# EAGLE design MEP_SAO (EAGLE 9.0.1)
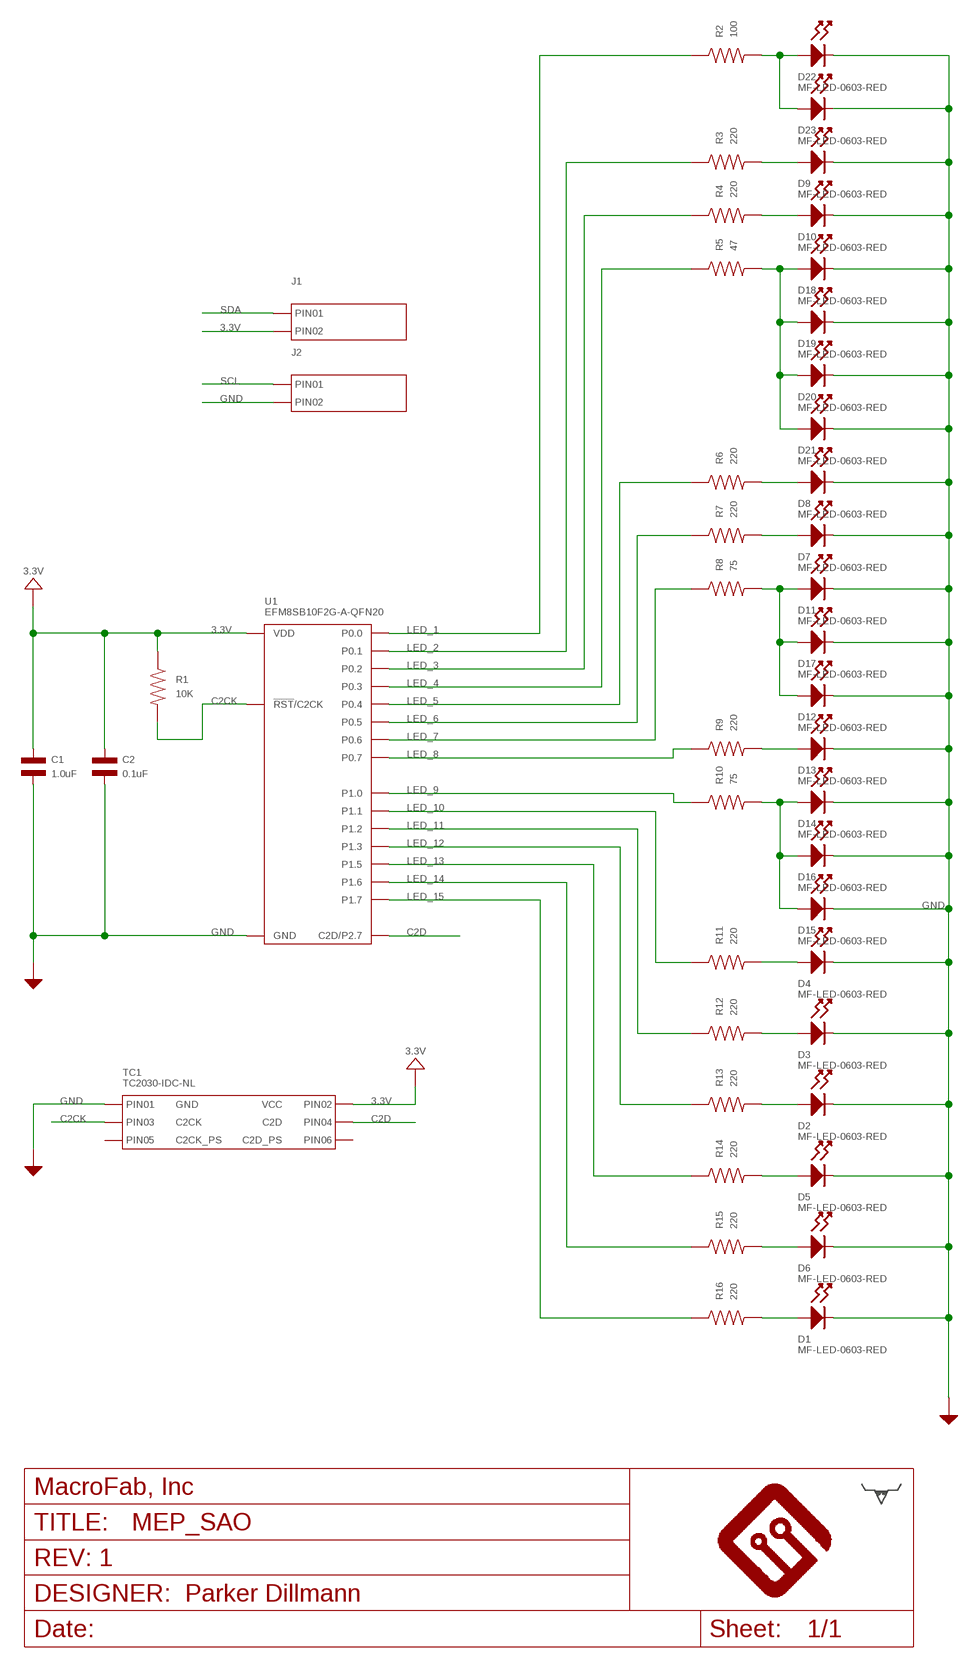
[diagram p0: schematic, sheet 1]

## Parts
C1  1.0uF  CAPACITOR_NP_0603  [C0603]
C2  0.1uF  CAPACITOR_NP_0603  [C0603]
D1  MF-LED-0603-RED  LED_SINGLE-0603-RED  [LED0603]
D2  MF-LED-0603-RED  LED_SINGLE-0603-RED  [LED0603]
D3  MF-LED-0603-RED  LED_SINGLE-0603-RED  [LED0603]
D4  MF-LED-0603-RED  LED_SINGLE-0603-RED  [LED0603]
D5  MF-LED-0603-RED  LED_SINGLE-0603-RED  [LED0603]
D6  MF-LED-0603-RED  LED_SINGLE-0603-RED  [LED0603]
D7  MF-LED-0603-RED  LED_SINGLE-0603-RED  [LED0603]
D8  MF-LED-0603-RED  LED_SINGLE-0603-RED  [LED0603]
D9  MF-LED-0603-RED  LED_SINGLE-0603-RED  [LED0603]
D10  MF-LED-0603-RED  LED_SINGLE-0603-RED  [LED0603]
D11  MF-LED-0603-RED  LED_SINGLE-0603-RED  [LED0603]
D12  MF-LED-0603-RED  LED_SINGLE-0603-RED  [LED0603]
D13  MF-LED-0603-RED  LED_SINGLE-0603-RED  [LED0603]
D14  MF-LED-0603-RED  LED_SINGLE-0603-RED  [LED0603]
D15  MF-LED-0603-RED  LED_SINGLE-0603-RED  [LED0603]
D16  MF-LED-0603-RED  LED_SINGLE-0603-RED  [LED0603]
D17  MF-LED-0603-RED  LED_SINGLE-0603-RED  [LED0603]
D18  MF-LED-0603-RED  LED_SINGLE-0603-RED  [LED0603]
D19  MF-LED-0603-RED  LED_SINGLE-0603-RED  [LED0603]
D20  MF-LED-0603-RED  LED_SINGLE-0603-RED  [LED0603]
D21  MF-LED-0603-RED  LED_SINGLE-0603-RED  [LED0603]
D22  MF-LED-0603-RED  LED_SINGLE-0603-RED  [LED0603]
D23  MF-LED-0603-RED  LED_SINGLE-0603-RED  [LED0603]
FRAME1  MF_FRAMEDEFAULT  [MF_FRAME_DEFAULT]
J1  CON_01X02_2.54MM_PIN_HEADER  [2.54MM_01X02_PIN_HEADER]
J2  CON_01X02_2.54MM_PIN_HEADER  [2.54MM_01X02_PIN_HEADER]
R1  10K  RESISTOR_0402  [R0402]
R2  100  RESISTOR_0402  [R0402]
R3  220  RESISTOR_0402  [R0402]
R4  220  RESISTOR_0402  [R0402]
R5  47  RESISTOR_0402  [R0402]
R6  220  RESISTOR_0402  [R0402]
R7  220  RESISTOR_0402  [R0402]
R8  75  RESISTOR_0402  [R0402]
R9  220  RESISTOR_0402  [R0402]
R10  75  RESISTOR_0402  [R0402]
R11  220  RESISTOR_0402  [R0402]
R12  220  RESISTOR_0402  [R0402]
R13  220  RESISTOR_0402  [R0402]
R14  220  RESISTOR_0402  [R0402]
R15  220  RESISTOR_0402  [R0402]
R16  220  RESISTOR_0402  [R0402]
TC1  TC2030-IDC-NL  CON_02X03_SILABS2TC_TC2030-IDC-NL  [TC2030-IDC-NL]
U1  EFM8SB10F2G-A-QFN20  EFM8SB10F(2/4/8)G-A-QFN20  [EFM8SB10F(2/4/8)G-A-QFN20]
U$6  LHE_LOGOLHE_LOGO  [LHE_LOGO]

## Nets
3.3V: C1.P$1 C2.P$1 J1.2(PIN2) R1.P$1 TC1.P$2(PIN2) U1.P$4(VDD)
C2CK: R1.P$2 TC1.P$3(PIN3) U1.P$5(!RST!/C2CK)
C2D: TC1.P$4(PIN4) U1.P$6(C2D/P2.7)
GND: C1.P$2 C2.P$2 D1.CATHODE D2.CATHODE D3.CATHODE D4.CATHODE D5.CATHODE D6.CATHODE D7.CATHODE D8.CATHODE D9.CATHODE D10.CATHODE D11.CATHODE D12.CATHODE D13.CATHODE D14.CATHODE D15.CATHODE D16.CATHODE D17.CATHODE D18.CATHODE D19.CATHODE D20.CATHODE D21.CATHODE D22.CATHODE D23.CATHODE J2.2(PIN2) TC1.P$1(PIN1) U1.P$3(GND) U1.P$12(GND) U1.PAD(GND)
LED_1: R2.P$1 U1.P$2(P0.0)
LED_2: R3.P$1 U1.P$1(P0.1)
LED_3: R4.P$1 U1.P$20(P0.2)
LED_4: R5.P$1 U1.P$19(P0.3)
LED_5: R6.P$1 U1.P$18(P0.4)
LED_6: R7.P$1 U1.P$17(P0.5)
LED_7: R8.P$1 U1.P$16(P0.6)
LED_8: R9.P$1 U1.P$15(P0.7)
LED_9: R10.P$1 U1.P$14(P1.0)
LED_10: R11.P$1 U1.P$13(P1.1)
LED_11: R12.P$1 U1.P$11(P1.2)
LED_12: R13.P$1 U1.P$10(P1.3)
LED_13: R14.P$1 U1.P$9(P1.5)
LED_14: R15.P$1 U1.P$8(P1.6)
LED_15: R16.P$1 U1.P$7(P1.7)
N$1: D22.ANODE D23.ANODE R2.P$2
N$2: D18.ANODE D19.ANODE D20.ANODE D21.ANODE R5.P$2
N$3: D10.ANODE R4.P$2
N$4: D7.ANODE R7.P$2
N$5: D1.ANODE R16.P$2
N$6: D13.ANODE R9.P$2
N$7: D9.ANODE R3.P$2
N$8: D8.ANODE R6.P$2
N$9: D6.ANODE R15.P$2
N$10: D5.ANODE R14.P$2
N$11: D2.ANODE R13.P$2
N$12: D3.ANODE R12.P$2
N$13: D4.ANODE R11.P$2
N$17: D14.ANODE D15.ANODE D16.ANODE R10.P$2
N$20: D11.ANODE D12.ANODE D17.ANODE R8.P$2
SCL: J2.1(PIN1)
SDA: J1.1(PIN1)
Unconnected: TC1.P$5(PIN5) TC1.P$6(PIN6)

## Library data of the parts
C1 = MF_Passives:CAPACITOR_NP: Library: MF_Passives Description: Device for Non-Polarized Capacitors. Manufacture part number (MPN) can be added via Attributes. Check https://factory.macrofab.com/parts for the house parts list.; MPN: MF-CAP-0603-1uF; POPULATE: 1
C2 = MF_Passives:CAPACITOR_NP: Library: MF_Passives Description: Device for Non-Polarized Capacitors. Manufacture part number (MPN) can be added via Attributes. Check https://factory.macrofab.com/parts for the house parts list.; MPN: MF-CAP-0603-0.1uF; POPULATE: 1
D1-D23 = MF_LEDs:LED_SINGLE: Library: MF_LEDs Description: Device for Single LED Packages. Manufacture part number (MFG#) can be added via Attributes.; HOUSEPART: YES; MPN: MF-LED-0603-RED; POPULATE: 1; URL: https://factory.macrofab.com/part/MF-LED-0603-RED
FRAME1 = MF_Aesthetics:MF_FRAME: Library: MF_Aesthetics Description: Frame for adding Meta Data to the PCB and Schematic.; DNAME: Parker Dillmann; HOUSEPART: 0; POPULATE: 0; REVNUM: REV: 1
J1 J2 = PP_Connectors:CON_01X02; POPULATE: 0
R1 = MF_Passives:RESISTOR: Library: MF_Passives Description: Device for Resistors. Manufacture part number (MPN), Voltage, Tolerance, and Wattage Rating can be added via Attributes. Check https://factory.macrofab.com/parts for the house parts list.; MPN: MF-RES-0402-10K; POPULATE: 1
R2 = MF_Passives:RESISTOR: Library: MF_Passives Description: Device for Resistors. Manufacture part number (MPN), Voltage, Tolerance, and Wattage Rating can be added via Attributes. Check https://factory.macrofab.com/parts for the house parts list.; MPN: MF-RES-0402-100; POPULATE: 1
R3 R4 R6 R7 R9 R11-R16 = MF_Passives:RESISTOR: Library: MF_Passives Description: Device for Resistors. Manufacture part number (MPN), Voltage, Tolerance, and Wattage Rating can be added via Attributes. Check https://factory.macrofab.com/parts for the house parts list.; MPN: MF-RES-0402-220; POPULATE: 1
R5 = MF_Passives:RESISTOR: Library: MF_Passives Description: Device for Resistors. Manufacture part number (MPN), Voltage, Tolerance, and Wattage Rating can be added via Attributes. Check https://factory.macrofab.com/parts for the house parts list.; MPN: MF-RES-0402-47; POPULATE: 1
R8 R10 = MF_Passives:RESISTOR: Library: MF_Passives Description: Device for Resistors. Manufacture part number (MPN), Voltage, Tolerance, and Wattage Rating can be added via Attributes. Check https://factory.macrofab.com/parts for the house parts list.; MPN: MF-RES-0402-75; POPULATE: 1
TC1 = MF_Connectors:CON_02X03: Library: MF_Connectors Description: Header Connector with 6 Positions and 02 Rows. Use the LABEL Attribute to label the pin on the schematic and PCB. You can remove the attributes on the PCB by using the SMASH function on the part and then deleting the text.; HOUSEPART: NO; LABEL01: GND; LABEL02: VCC; LABEL03: C2CK; LABEL04: C2D; LABEL05: C2CK_PS; LABEL06: C2D_PS; MPN: TC2030-IDC-NL; POPULATE: 0; URL: http://www.tag-connect.com/TC2030-IDC-NL
U1 = MF_IC_Digital:EFM8SB10F(2/4/8)G-A-QFN20: Manufacturer Part #: EFM8SB10F(2/4/8)G-A-QFN20 Manufacturer: Silicon Labs Description: Sleepy Bee 8-bit Microcontrollers - MCU 8kB/512B RAM 12b ADC; HOUSEPART: NO; POPULATE: 1; URL: http://www.silabs.com/products/mcu/8-bit/efm8-sleepy-bee/pages/efm8-sleepy-bee.aspx
U$6 = PP_Aesthetics:LHE_LOGO; POPULATE: 0

## Board
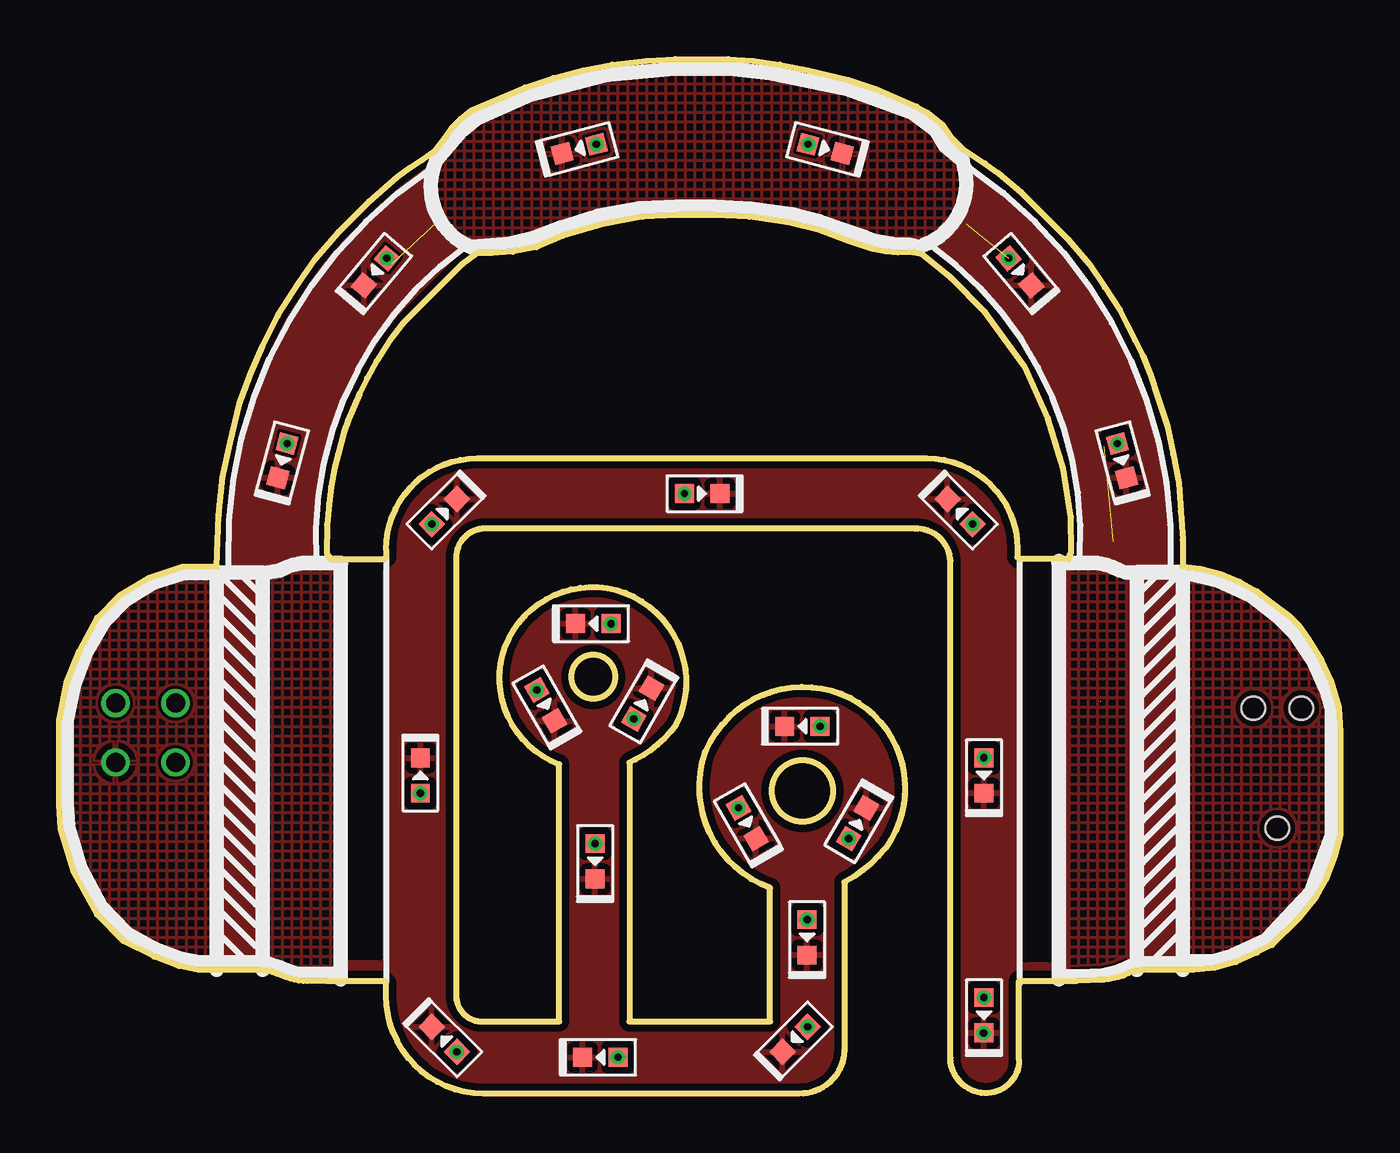
[diagram p1: board, top side]
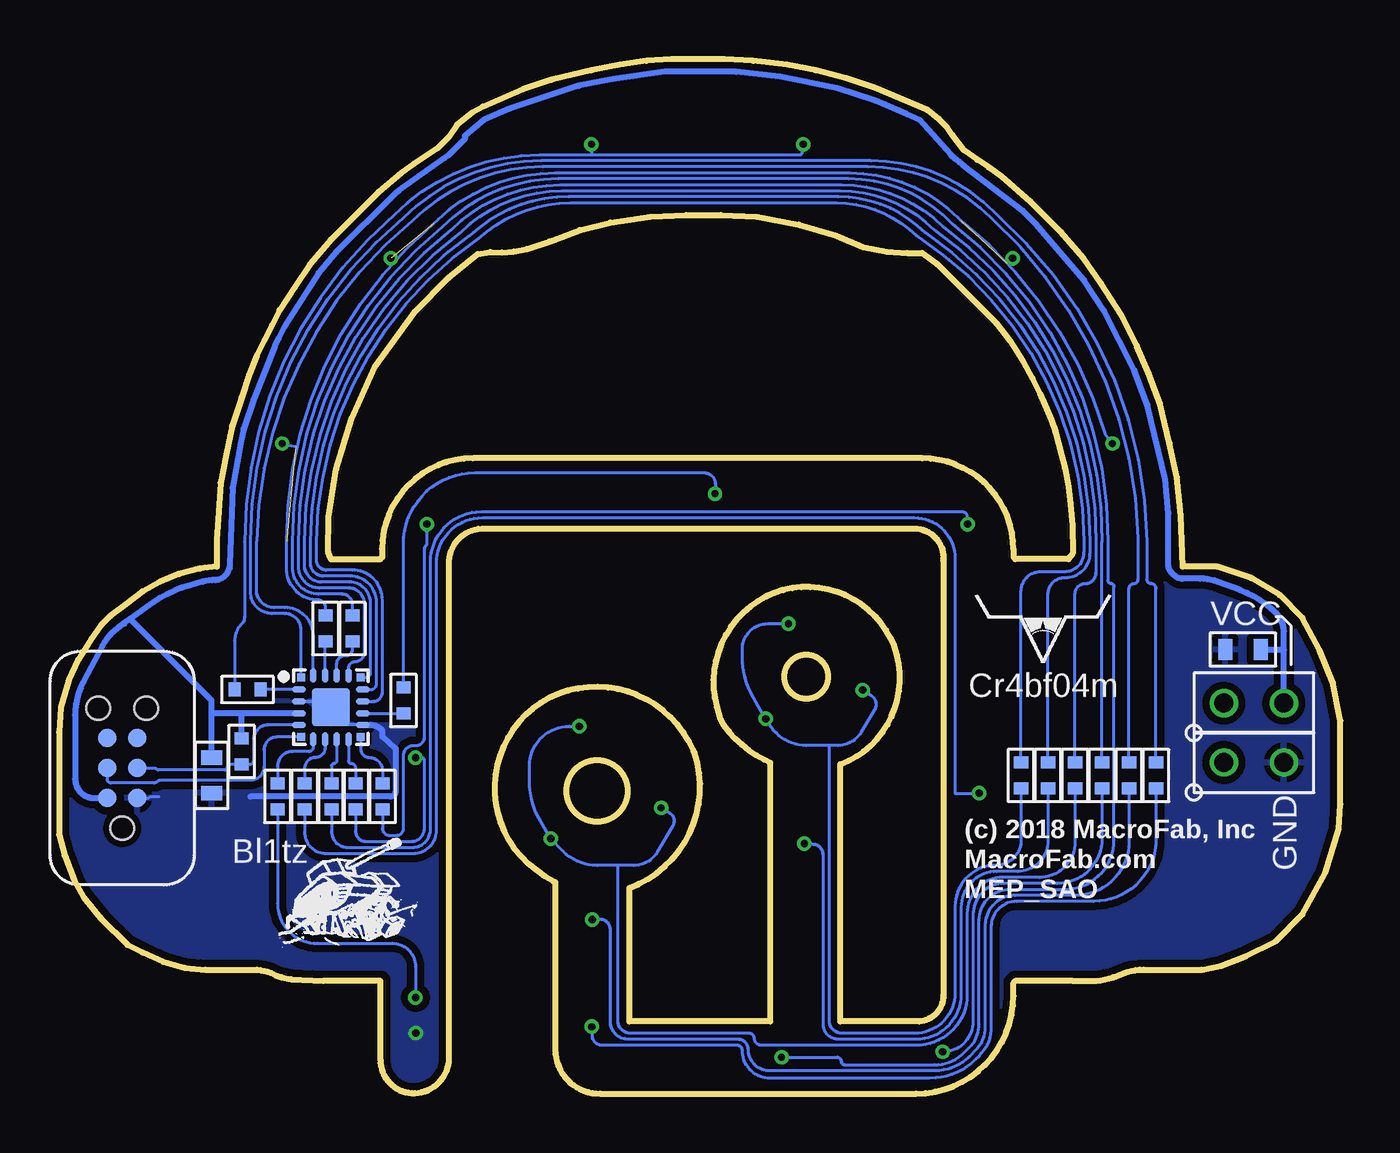
[diagram p2: board, bottom side, seen from below]

Size 54.28 x 43.83 mm. Coordinates in mm from the lower left corner, seen from the top.
Outline: 9.62,4.94 9.2,5.1 arc20 8.33,5.25 5.88,5.25 5.07,5.41 4.03,5.82 2.74,6.46 1.61,7.59 0.64,9.36 0.08,11.21 0,12.26 0,15.8 0.32,17.41 0.89,18.78 1.61,20.15 2.58,21.12 3.78,21.84 5.23,22.33 6.68,22.33 6.76,24.5 6.93,26.11 7.25,27.56 7.65,29.25 8.13,30.54 8.62,31.67 9.26,32.96 10.15,34.33 10.87,35.37 11.84,36.5 13.13,37.79 14.33,38.84 14.9,39.24 15.38,39.56 15.95,39.96 16.43,40.61 16.65,40.93 17,41.28 17.48,41.65 19.73,42.62 20.94,43.02 22.23,43.35 23.44,43.59 24.88,43.75 26.09,43.83 28.35,43.83 29.39,43.75 30.52,43.59 31.73,43.35 33.42,42.94 34.63,42.54 36.32,41.82 36.77,41.56 37.42,41.04 37.77,40.53 38.25,40.04 39.22,39.4 39.78,39 40.75,38.19 42.76,36.18 43.65,35.13 44.29,34.16 44.94,33.2 45.26,32.55 45.58,31.91 45.9,31.27 46.23,30.46 46.55,29.49 46.95,28.29 47.19,27.08 47.43,25.87 47.52,24.66 47.6,23.45 47.6,22.33 48.32,22.25 49.21,22 50.01,21.68 50.74,21.28 51.46,20.72 52.11,20.23 52.51,19.83 52.91,19.27 53.47,18.38 53.88,17.49 54.2,16.37 54.28,15.32 54.28,10.97 54.04,10.08 53.64,9.04 53.23,8.31 52.51,7.43 51.38,6.3 50.74,5.98 49.85,5.57 48.96,5.33 48.08,5.25 45.89,5.25 arc14 45.3,5.11 45.1,5.01 44.86,4.93 44.45,4.85 43.09,4.77 40.67,4.77 40.67,1.42 arc-87 39.35,0.02 arc-93 37.76,1.51 37.76,22.57 arc90 36.24,23.94 17.92,23.94 arc90 16.83,22.57 16.83,4.18 arc89 17.85,3.06 21.18,3.06 21.18,13.95 arc-89 18.9,18.94 arc-94 24.33,21.06 24.33,21.05 arc-90 26.13,15.62 arc-28 24.4,14.15 24.16,14.03 24.16,3.06 30.12,3.06 30.12,8.72 arc-88 27.35,14.43 27.41,14.54 arc-93 33.52,16.77 arc-98 35.01,10.4 arc-23 33.32,8.99 33.26,8.96 33.26,1.85 arc-90 31.35,0 17.97,0 arc-90 13.85,4.14 13.85,4.69 13.77,4.77 11.36,4.77 10.53,4.77 arc-20 9.62,4.94
Outline: 42.76,22.65 42.88,22.95 42.86,24.42 42.54,26.45 41.89,28.61 40.91,30.78 39.22,33.12 37.77,34.57 36.55,35.57 36.02,35.65 35.52,35.63 35.02,35.68 34.47,35.78 33.5,36.1 32.21,36.58 30.93,36.9 29.23,37.14 27.7,37.22 26.25,37.22 24.72,37.14 22.95,36.82 21.34,36.34 20.21,35.86 19.21,35.66 18.36,35.61 17.72,35.61 17.07,35.13 14.58,32.63 14.01,31.91 13.45,31.02 13.05,30.3 12.72,29.65 12.24,28.53 12.08,28.04 11.82,27.08 11.68,26.51 11.52,25.71 11.44,24.98 11.36,24.1 11.34,22.89 11.52,22.65 13.77,22.65 13.85,22.73 13.85,23.05 arc-90 17.72,26.92 36.75,26.92 arc-90 40.6,23.07 40.59,22.73 40.67,22.65 42.76,22.65
Outline: circle at 22.63,17.65 radius 0.92
Outline: circle at 31.49,12.82 radius 1.3
Copper layers (1*16): Top 0.035mm / dielectric 1.5mm / Bottom 0.035mm
Design rules "MF_Standard_2_Layer": minimum track width 5mil, minimum drill 12mil, track to track 5mil, track to pad 5mil, pad to pad 5mil, via to via 5mil, smd to smd 0mil, copper to edge 10mil, drill to drill 10mil, minimum pad ring 6mil, minimum via ring 6mil, stop-mask expansion 2mil, vias tented up to drill 25mil, thermal gap 10mil

### Footprints (pad centres in the part's own frame; a part is rotated, then mirrored left to right if it is on the bottom)
C0603 = smd 0.6 x 0.9: P$1 -0.75,0; P$2 0.75,0
LED0603 = smd 0.8 x 0.8: ANODE 0.75,0; CATHODE -0.75,0
2.54MM_01X02_PIN_HEADER = drill 0.8: 1 -1.27,0; 2 1.27,0
R0402 = smd 0.5 x 0.6: P$1 -0.55,0; P$2 0.55,0
TC2030-IDC-NL = smd 0.787 x 0.787: P$1 -1.27,-0.635; P$2 -1.27,0.635; P$3 0,-0.635; P$4 0,0.635; P$5 1.27,-0.635; P$6 1.27,0.635 | hole 0.991: 2.54,1.016; 2.54,-1.016; -2.54,0
EFM8SB10F(2/4/8)G-A-QFN20 = smd 0.34 x 0.34: P$1 -1.265,1.265; P$6 -1.265,-1.265; P$11 1.265,-1.265; P$16 1.265,1.265 | smd 0.61 x 0.28: P$2 -1.355,0.75; P$3 -1.355,0.25; P$4 -1.355,-0.25; P$5 -1.355,-0.75; P$12 1.355,-0.75; P$13 1.355,-0.25; P$14 1.355,0.25; P$15 1.355,0.75 | smd 0.28 x 0.61: P$7 -0.75,-1.355; P$8 -0.25,-1.355; P$9 0.25,-1.355; P$10 0.75,-1.355; P$17 0.75,1.355; P$18 0.25,1.355; P$19 -0.25,1.355; P$20 -0.75,1.355 | smd 1.6 x 1.6: PAD 0,0

### Placement (x,y rotation side)
C1  4.13,18.81 180 bottom
C2  47.82,13.48 270 bottom
D1  39.18,3.32 90 top
D2  39.18,13.48 90 top
D3  38.17,24.66 315 top
D4  27.24,25.42 180 top
D5  16.32,24.66 225 top
D6  15.31,13.48 270 top
D7  16.32,2.3 315 top
D8  22.93,1.54 0 top
D9  31.18,2.3 45 top
D10  31.69,6.62 90 top
D11  33.82,11.45 240 top
D12  31.49,15.56 0 top
D13  22.71,9.84 90 top
D14  24.72,16.53 240 top
D15  22.63,19.91 0 top
D16  20.62,16.45 120 top
D17  29.15,11.45 120 top
D18  45.02,26.81 105 top
D19  40.71,34.82 130 top
D20  13.4,34.82 50 top
D21  9.46,26.81 75 top
D22  32.45,40.02 165 top
D23  22.04,40.02 15 top
FRAME1  15.94,12.08 0 bottom
J1  3.67,16.54 0 bottom
J2  3.67,14.03 0 bottom
R1  46.55,14.5 270 bottom
R2  46.29,17.12 180 bottom
R3  7.81,13.48 270 bottom
R4  8.96,13.48 270 bottom
R5  42.99,19.7 90 bottom
R6  41.85,19.7 90 bottom
R7  10.1,13.48 270 bottom
R8  11.24,13.48 270 bottom
R9  12.38,13.48 270 bottom
R10  13.53,13.48 270 bottom
R11  39.69,16.65 90 bottom
R12  40.58,12.59 270 bottom
R13  41.72,12.59 270 bottom
R14  42.74,12.59 270 bottom
R15  43.88,12.59 270 bottom
R16  45.02,12.59 270 bottom
TC1  51.6,13.79 90 bottom
U1  42.76,16.37 0 bottom
U$6  10.61,18.18 0 bottom

### Tracks (layer width: path | path; a pad name or v marks a point on that pad's centre or on a via)
3.3V
  Bottom 0.254: J1.2 2.4,18.81 | 2.4,18.81 2.4,19.58 arc-45 2.71,20.34 arc-25 4.25,21.33 5.2,21.68 arc-20 5.95,21.82 6.69,21.82 arc45 7.04,21.96 7.18,22.1 7.18,22.11 arc45 7.28,22.35 7.28,24.58 7.43,26.01 8.18,29.17 8.73,30.63 10.02,33.16 10.87,34.47 12.89,36.84 13.47,37.41 15.97,39.31 arc11 16.15,39.48 | 16.15,39.48 | 16.15,39.48 16.16,39.49 16.3,39.6 | 16.3,39.6 | 16.3,39.6 arc13 16.5,39.77 17.83,41.25 18.36,41.48 19.69,42.05 21.33,42.6 23.73,43.08 25.6,43.29 25.8,43.3 28.63,43.3 30.83,42.98 32.26,42.7 35.2,41.72 36.28,41.26 37.09,40.57 37.09,40.45 37.8,39.74 37.93,39.65 39.89,38.25 40.06,38.11 42.54,35.65 43.29,34.76 44.72,32.51 44.97,32 45.15,31.65 46.04,29.4 46.46,28.15 46.58,27.56 46.93,25.67 47.04,22.43 arc45 47.29,21.9 arc43 47.66,21.76 arc-15 48.19,21.69 48.74,21.54 arc-20 50.28,20.81 51.27,20.11 | 51.27,20.11 51.56,19.91 | 51.56,19.91 arc-10 52.08,19.47 arc-17 52.44,18.99 53.25,17.44 arc-28 53.59,16.04 53.59,13.33 arc-90 52.79,12.52 TC1.P$2 | C1.P$1 2.4,18.81 | 51.52,19.91 51.56,19.91 | C2.P$1 47.82,16.12 | 47.82,16.12 47.82,16.66 51.27,20.11 | U1.P$4 46.55,16.12 | 46.55,16.12 47.82,16.12 | R1.P$1 46.55,16.12
C2CK
  Bottom 0.127: U1.P$5 45.43,15.62 arc-90 46.04,15.01 46.04,14.1 arc90 46.2,13.95 R1.P$2 47.02,13.95 arc-90 47.16,13.81 arc90 47.25,13.71 50.08,13.71 arc45 50.12,13.73 arc-45 50.26,13.78 TC1.P$3
C2D
  Bottom 0.127: TC1.P$4 52.24,13.32 arc-90 52.08,13.16 50.25,13.16 arc-45 50.13,13.21 arc45 49.98,13.28 46.17,13.28 arc-90 45.59,13.86 45.59,14.57 arc90 45.06,15.1 U1.P$6
GND  (via drill 0.3)  (1 unrouted)
  Bottom 0.127: TC1.P$1 50.48,12.52 50.41,12.59 50.04,12.59 | U1.P$12 41.47,15.62 41.47,15.64
  Bottom 0.152: 41.47,15.64 42.1,15.64 42.36,15.89 | 43.37,16.6 44.13,16.6
  Bottom 0.254: U1.P$12 41.14,15.62 arc45 40.58,15.38 40.58,15.13 40.02,14.62 40.02,12.81 arc90 40.23,12.59 46.17,12.59 | 43.37,16.6 43,16.6 U1.PAD 42.36,15.96 42.36,15.89
  other vias: 39.17,2.57
  pour Top (isolate 0.305, rank 6): 9.32,-0.61 11.7,4.8 11.7,22.65 15.86,41.49 15.91,41.49 15.91,40.05 15.68,39.01 15.81,37.74 16.44,36.58 17.71,35.58 36.39,35.58 37.54,36.34 38.15,37.49 38.53,38.63 38.15,40.13 38.15,42.25 58.05,22.25 42.81,22.29 42.78,4.77 44.96,-0.61
  pour Bottom (isolate 0.305, rank 6): 9.32,-0.61 -0.32,9.03 -0.32,25.31 18.59,44.21 36.18,44.21 54.93,25.46 54.93,9.36 44.96,-0.61
  pour Top (hatched): 15.93,44.64 15.91,39.96 15.68,38.99 15.83,37.72 16.46,36.6 17.71,35.56 36.44,35.58 37.56,36.34 38.17,37.47 38.55,38.63 38.17,40.13 38.17,44.6
  pour Top (hatched): 6.69,22.72 -0.59,22.74 -0.63,4.97 6.52,4.97
  pour Top (hatched): 55.03,22.32 47.61,22.36 47.59,4.61 54.87,4.56
  pour Top (hatched): 42.81,22.29 43.95,22.3 44.46,22.17 44.84,22 45.13,21.89 45.24,21.89 45.24,5.79 44.62,5.56 44.16,5.45 42.78,5.39 42.81,22.3
  pour Top: 45.32,23.1 47.63,23.1 47.63,4.56 45.32,4.56
  pour Top: 6.65,4.86 8.83,4.9 8.83,22.4 6.65,22.36
  pour Top: 6.62,22.15 9.06,22.15 9.06,21.85 9.86,22.19 10.35,22.3 11.87,22.3 18.07,35.33 16.72,36.37 16.44,36.58 15.81,37.72 15.7,39.01 15.96,40.03 6.62,40.03
  pour Top (hatched): 8.87,21.87 9.88,22.19 10.35,22.3 11.68,22.32 11.72,5.18 9.54,5.39 8.85,5.73
LED_1
  Bottom 0.127: U1.P$2 45.11,17.12 R2.P$1
LED_2
  Bottom 0.127: U1.P$1 44.03,19.64 arc-90 44.73,20.34 45.26,20.34 arc90 46.17,21.25 46.17,23.39 arc51 39.69,37.1 arc45 33.86,39.51 19.88,39.51 arc45 14.67,37.36 14.54,37.23 arc48 8.19,23.39 8.19,21.77 arc-90 8.03,21.61 arc90 7.81,21.39 R3.P$1
LED_3
  Bottom 0.127: U1.P$20 43.51,19.38 arc-90 44.71,20.59 45.18,20.59 arc90 45.91,21.33 45.91,23.39 arc50 39.31,36.97 arc45 33.79,39.26 20.01,39.26 arc45 14.8,37.1 arc46 8.57,23.51 8.57,21.77 arc90 8.74,21.61 arc-90 8.96,21.39 R4.P$1
LED_4
  Bottom 0.127: U1.P$19 43.01,19.15 R5.P$1
LED_5
  Bottom 0.127: U1.P$18 42.51,18.2 arc90 42.16,18.56 42.11,18.56 arc-90 41.85,18.82 R6.P$1
LED_6
  Bottom 0.127: U1.P$17 42.01,18.03 arc90 41.73,18.31 arc-90 41.34,18.7 41.34,20.75 arc-90 42.01,21.42 43.25,21.42 arc90 44.13,22.31 44.13,23.39 arc52 37.66,36.59 arc45 33.06,38.5 21.12,38.5 arc45 16.83,36.72 arc54 10.1,23.39 R7.P$1
LED_7
  Bottom 0.127: U1.P$16 41.28,17.63 arc-90 41.09,17.83 41.09,20.78 arc-90 41.97,21.67 43.17,21.67 arc90 43.88,22.39 43.88,23.39 arc53 37.28,36.47 arc45 32.98,38.24 21.2,38.24 arc45 17.21,36.59 arc55 10.35,23.39 10.35,22.07 arc90 10.81,21.61 arc-90 11.24,21.18 R8.P$1
LED_8
  Bottom 0.127: U1.P$15 41.08,17.12 arc-90 40.83,17.36 40.83,20.82 arc-90 41.94,21.92 43.09,21.92 arc90 43.63,22.47 43.63,23.39 arc54 36.9,36.34 arc43 32.69,37.99 21.27,37.99 arc45 17.59,36.47 arc56 10.61,23.39 10.61,22.89 arc90 11.63,21.86 11.69,21.86 arc-90 12.38,21.17 R9.P$1
LED_9
  Bottom 0.127: U1.P$14 40.98,16.62 arc-90 40.58,17.02 40.58,20.9 arc-90 41.86,22.18 42.96,22.18 arc90 43.37,22.59 43.37,23.39 arc55 36.51,36.21 arc43 32.62,37.74 21.35,37.74 arc45 17.97,36.34 arc57 10.86,23.39 10.86,22.94 arc90 11.68,22.12 12.71,22.12 arc-90 13.53,21.3 R10.P$1
LED_10
  Bottom 0.127: U1.P$13 R11.P$1
LED_11
  Bottom 0.127: U1.P$11 41.5,14.6 arc-90 41.14,14.24 arc90 40.58,13.68 R12.P$1
LED_12
  Bottom 0.127: U1.P$10 42.01,14.1 arc-90 41.91,13.99 arc90 41.72,13.8 R13.P$1
LED_13
  Bottom 0.127: U1.P$9 42.51,14.11 arc90 42.63,13.99 arc-90 42.74,13.88 R14.P$1
LED_14
  Bottom 0.127: U1.P$8 43.01,14.63 arc90 43.4,14.24 arc-90 43.88,13.77 R15.P$1
LED_15
  Bottom 0.127: U1.P$7 43.51,14.67 arc90 43.69,14.5 44.39,14.5 arc-90 45.02,13.86 R16.P$1
N$1  (via drill 0.3)
  Bottom 0.127: 31.69,39.77 33.94,39.77 arc-45 40.07,37.23 arc-49 46.42,23.39 46.42,20.21 arc45 46.56,19.88 arc-45 46.84,19.18 R2.P$2 | 31.69,39.77 22.9,39.77 arc-90 22.8,39.87 22.8,40.15 22.73,40.21 22.74,40.22 D23.ANODE | D22.ANODE 31.73,39.81 31.69,39.77
  other vias: 22.76,40.22 31.73,40.22
N$2  (via drill 0.3)  (3 unrouted)
  Bottom 0.127: R5.P$2 42.99,20.6 arc-90 43.3,20.91 arc90 44.64,22.25 44.64,23.39 arc50 38.42,36.85 38.21,37.05 arc43 33.28,39.01 20.78,39.01 arc45 16.2,37.11 16.07,36.97 arc35 9.97,27.96 D21.ANODE 9.74,27.54 | D18.ANODE 44.26,27.41 | D20.ANODE 14.11,35.17
  other vias: 44.83,27.54 40.22,35.39 13.88,35.39 9.66,27.54
N$3  (via drill 0.3)
  Bottom 0.127: R4.P$2 8.96,10.68 arc90 11.23,8.4 13.78,8.4 arc-90 15.05,7.13 15.05,2.83 arc45 15.47,1.83 15.73,1.57 arc45 17.16,0.97 24.18,0.97 arc90 25.08,1.87 arc-90 25.52,2.3 30.17,2.3 arc90 30.93,3.06 30.93,6.95 arc-90 31.36,7.38 31.69,7.38 D10.ANODE
  other vias: 31.69,7.37
N$4  (via drill 0.3)
  Bottom 0.127: R7.P$2 10.1,10.81 arc90 12,8.91 14.26,8.91 arc-90 15.56,7.61 15.56,3.07 arc90 D7.ANODE
  other vias: 16.85,1.77
N$5  (via drill 0.3)
  Bottom 0.127: R16.P$2 45.02,8.05 arc-90 43.34,6.37 40.17,6.37 arc90 39.18,5.38 D1.ANODE 39.18,4.02
  other vias: 39.18,4.07
N$6  (via drill 0.3)
  Bottom 0.127: R9.P$2 12.38,10.72 arc90 13.69,9.42 14.56,9.42 arc-90 16.07,7.9 16.07,4.21 arc90 17.97,2.3 21.27,2.3 arc90 21.91,2.94 21.91,10.12 arc-90 22.34,10.56 22.71,10.56 D13.ANODE
  other vias: 22.71,10.59
N$7  (via drill 0.3)
  Bottom 0.127: R3.P$2 7.81,10.78 arc90 10.45,8.15 13.72,8.15 arc-90 14.8,7.07 14.8,2.82 arc45 15.3,1.61 15.45,1.46 arc45 17.39,0.65 24.16,0.65 arc90 25.34,1.83 arc-90 25.56,2.05 31.28,2.05 arc90 31.69,2.46 31.69,2.83 D9.ANODE
  other vias: 31.71,2.83
N$8  (via drill 0.3)
  Bottom 0.127: R6.P$2 41.85,20.71 arc-90 42.3,21.16 43.28,21.16 arc90 44.39,22.27 44.39,23.39 arc51 38.04,36.72 arc45 33.13,38.75 20.83,38.75 arc47 16.45,36.85 arc53 9.84,23.39 9.84,21.73 arc-90 9.72,21.61 arc90 9.59,21.48 9.59,10.75 arc90 11.68,8.65 14,8.65 arc-90 15.31,7.35 15.31,2.95 arc45 15.72,1.95 15.92,1.75 arc45 17.19,1.22 21,1.22 arc90 21.15,1.37 arc-90 21.32,1.54 D8.ANODE
  other vias: 23.68,1.54
N$9  (via drill 0.3)
  Bottom 0.127: R15.P$2 43.88,11.08 arc-90 42.97,10.18 39.27,10.18 arc-90 38.29,11.16 38.29,22.46 arc90 36.35,24.4 18.06,24.4 arc90 16.32,22.67 16.32,12.72 15.31,12.72 | 15.18,12.72 15.31,12.72 | 15.31,12.72 D6.ANODE
  other vias: 15.31,12.73
N$10  (via drill 0.3)
  Bottom 0.127: R14.P$2 42.74,11.12 arc-90 42.05,10.43 39.31,10.43 arc-90 38.55,11.19 38.55,22.51 arc90 36.4,24.66 16.03,24.66 arc90 15.81,24.44 15.81,24.13 D5.ANODE
  other vias: 15.79,24.12
N$11  (via drill 0.3)
  Bottom 0.127: R13.P$2 41.72,11.12 arc-90 41.29,10.69 39.36,10.69 arc-90 38.8,11.24 38.8,14.11 arc-90 38.93,14.24 D2.ANODE
  other vias: 39.18,14.23
N$12  (via drill 0.3)
  Bottom 0.127: R12.P$2 40.58,11.24 arc-90 40.28,10.94 39.98,10.94 arc-90 39.69,11.23 39.69,14.32 arc90 39.26,14.75 39.15,14.75 arc-90 38.8,15.1 38.8,23.04 arc45 38.72,23.23 arc-45 38.7,23.3 D3.ANODE
  other vias: 38.7,24.12
N$13  (via drill 0.3)
  Bottom 0.127: R11.P$2 39.69,23.28 arc90 36.67,26.31 26.96,26.31 arc90 26.48,25.83 26.48,25.42 D4.ANODE
  other vias: 26.49,25.42
N$14
  cutout Top: 12.23,23.1 13.59,23.1 13.59,5.77 12.23,5.77
  cutout Top: 40.92,23.04 41.94,23.06 41.94,5.69 40.92,5.69
N$15
  cutout Top: 44.79,4.31 55.92,4.31 55.92,23.18 49.03,23.18 49.03,23.04 49.03,22.38 50.46,21.77 51.84,20.81 53.3,19.4 54.02,17.75 54.46,16.41 54.61,14.57 54.55,12.22 54.55,10.83 54.02,9.24 53.45,8.1 52.24,6.7 51.54,6 49.89,5.28 49.05,5.03 48.07,4.95 45.72,4.92
N$17  (via drill 0.3)
  Bottom 0.127: R10.P$2 13.53,10.75 arc90 14.61,9.67 arc-90 16.32,7.96 16.32,4.27 arc90 18.03,2.56 21.12,2.56 arc90 21.66,3.09 21.66,14.75 | 20.26,17.1 19.91,16.89 arc91 19.74,16.24 20.3,15.31 arc59 21.29,14.75 21.66,14.75 | 20.26,17.16 20.26,17.1 | 20.26,17.1 D16.ANODE | 21.66,14.75 22.62,14.75 arc61 24.21,15.68 24.32,15.88 D14.ANODE 24.87,16.79 arc30 25.34,18.54 25.34,18.83 arc90 24.26,19.91 D15.ANODE
  other vias: 20.24,17.1 24.35,15.88 23.38,19.91
N$20  (via drill 0.3)
  Bottom 0.127: 30.61,9.67 31.49,9.67 arc45 32.93,10.27 33.47,10.8 D11.ANODE 33.89,11.55 arc31 34.36,13.25 34.36,13.88 arc90 32.67,15.56 D12.ANODE | 28.77,12.21 D17.ANODE 28.44,11.91 arc91 28.29,11.33 28.94,10.23 arc59 29.93,9.67 30.61,9.67 | R8.P$2 11.24,10.67 arc90 12.75,9.16 14.3,9.16 arc-90 15.81,7.65 15.81,4.2 arc90 17.96,2.05 24.54,2.05 arc90 24.83,2.34 arc-90 25.05,2.56 30.07,2.56 arc90 30.61,3.09 30.61,9.67
  other vias: 33.45,10.8 28.78,12.1 32.24,15.56

### Text on the board
bPlace: VCC | Cr4bf04m | GND | Bl1tz